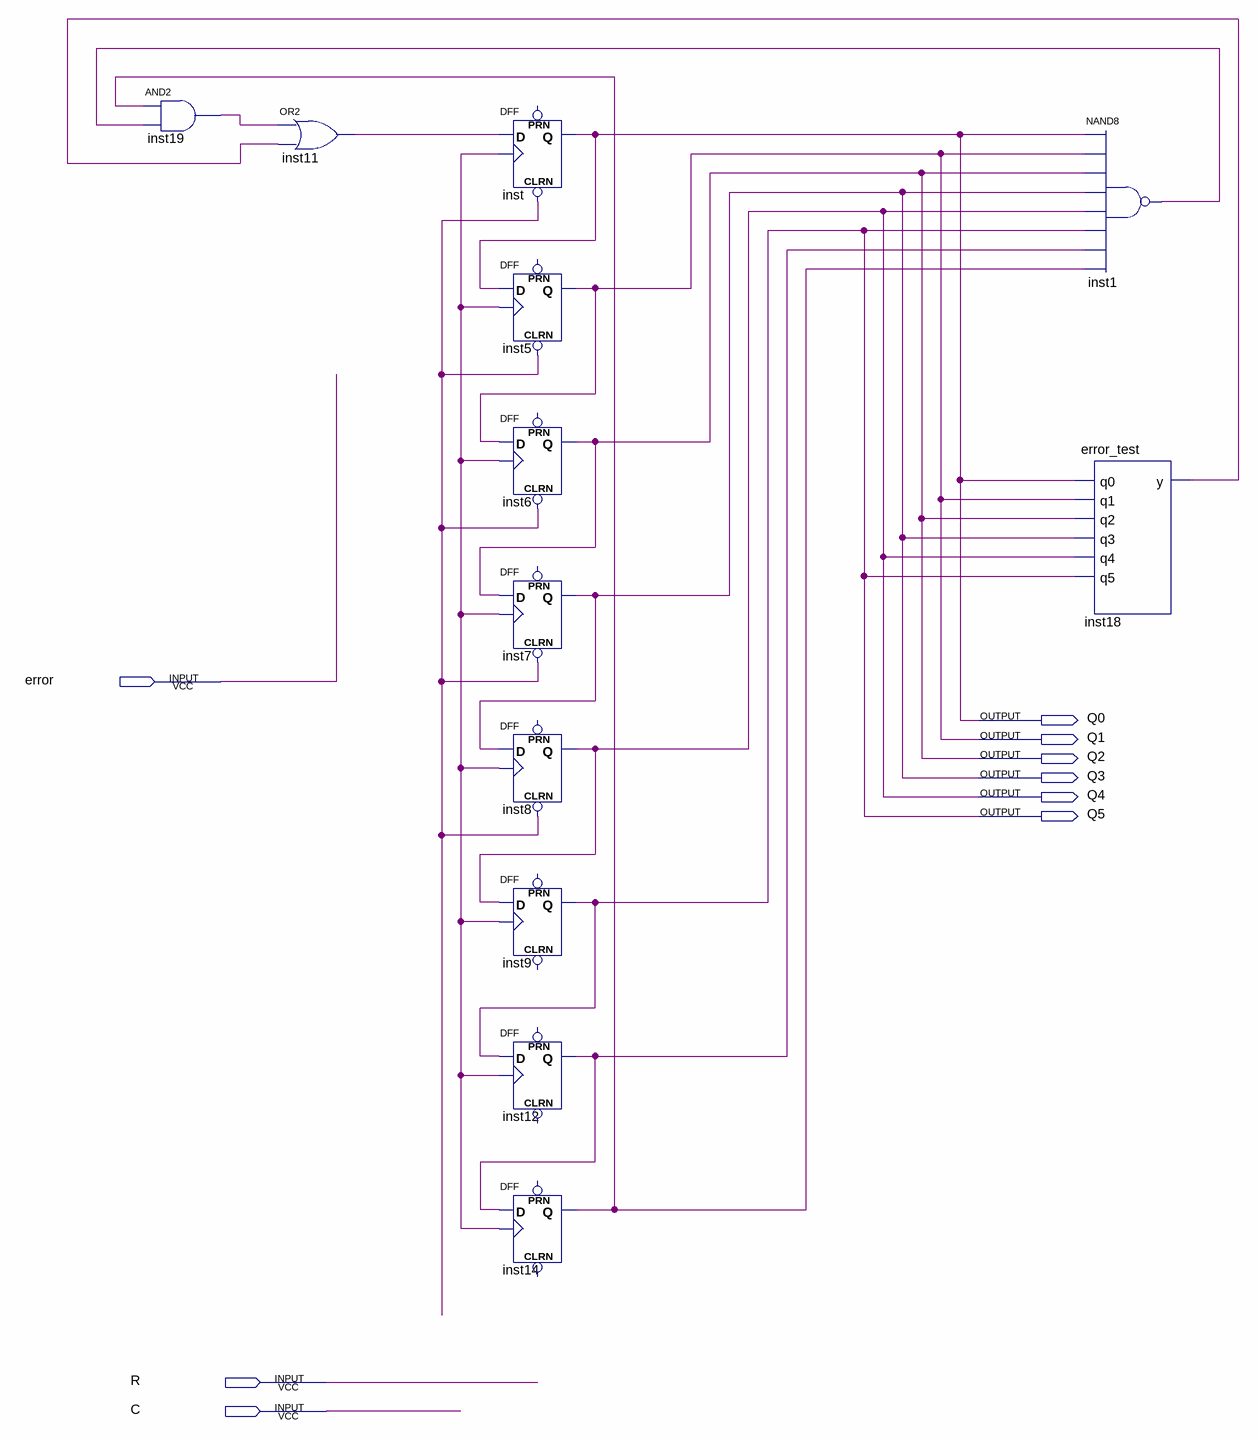
[diagram p0: schematic sheet]
// Quartus schematic Laboratory_work_6_1_project.bdf as structural Verilog: 12 symbols, 9 pins
module Laboratory_work_6_1_project (
  input  error,
  input  R,
  input  C,
  output Q0,
  output Q1,
  output Q2,
  output Q3,
  output Q4,
  output Q5
);

  wire inst1_out, inst11_out, inst12_q, inst14_q, inst18_y, inst19_out, undriven, undriven_2;

  and inst19 (inst19_out, inst14_q, inst1_out);
  or inst11 (inst11_out, inst19_out, inst18_y);
  DFF inst (.CLRN(undriven), .CLK(undriven_2), .D(inst11_out), .Q(Q0));  // open: PRN
  DFF inst5 (.CLRN(undriven), .CLK(undriven_2), .D(Q0), .Q(Q1));  // open: PRN
  DFF inst6 (.CLRN(undriven), .CLK(undriven_2), .D(Q1), .Q(Q2));  // open: PRN
  DFF inst7 (.CLRN(undriven), .CLK(undriven_2), .D(Q2), .Q(Q3));  // open: PRN
  DFF inst8 (.CLRN(undriven), .CLK(undriven_2), .D(Q3), .Q(Q4));  // open: PRN
  DFF inst9 (.CLK(undriven_2), .D(Q4), .Q(Q5));  // open: CLRN, PRN
  DFF inst12 (.CLK(undriven_2), .D(Q5), .Q(inst12_q));  // open: CLRN, PRN
  DFF inst14 (.CLK(undriven_2), .D(inst12_q), .Q(inst14_q));  // open: CLRN, PRN
  nand inst1 (inst1_out, Q0, Q1, Q2, Q3, Q4, Q5, inst12_q, inst14_q);
  error_test inst18 (.q0(Q0), .q1(Q1), .q2(Q2), .q3(Q3), .q4(Q4), .q5(Q5), .y(inst18_y));
endmodule
